# EAGLE design Module-StepDown (EAGLE 6.6.0)
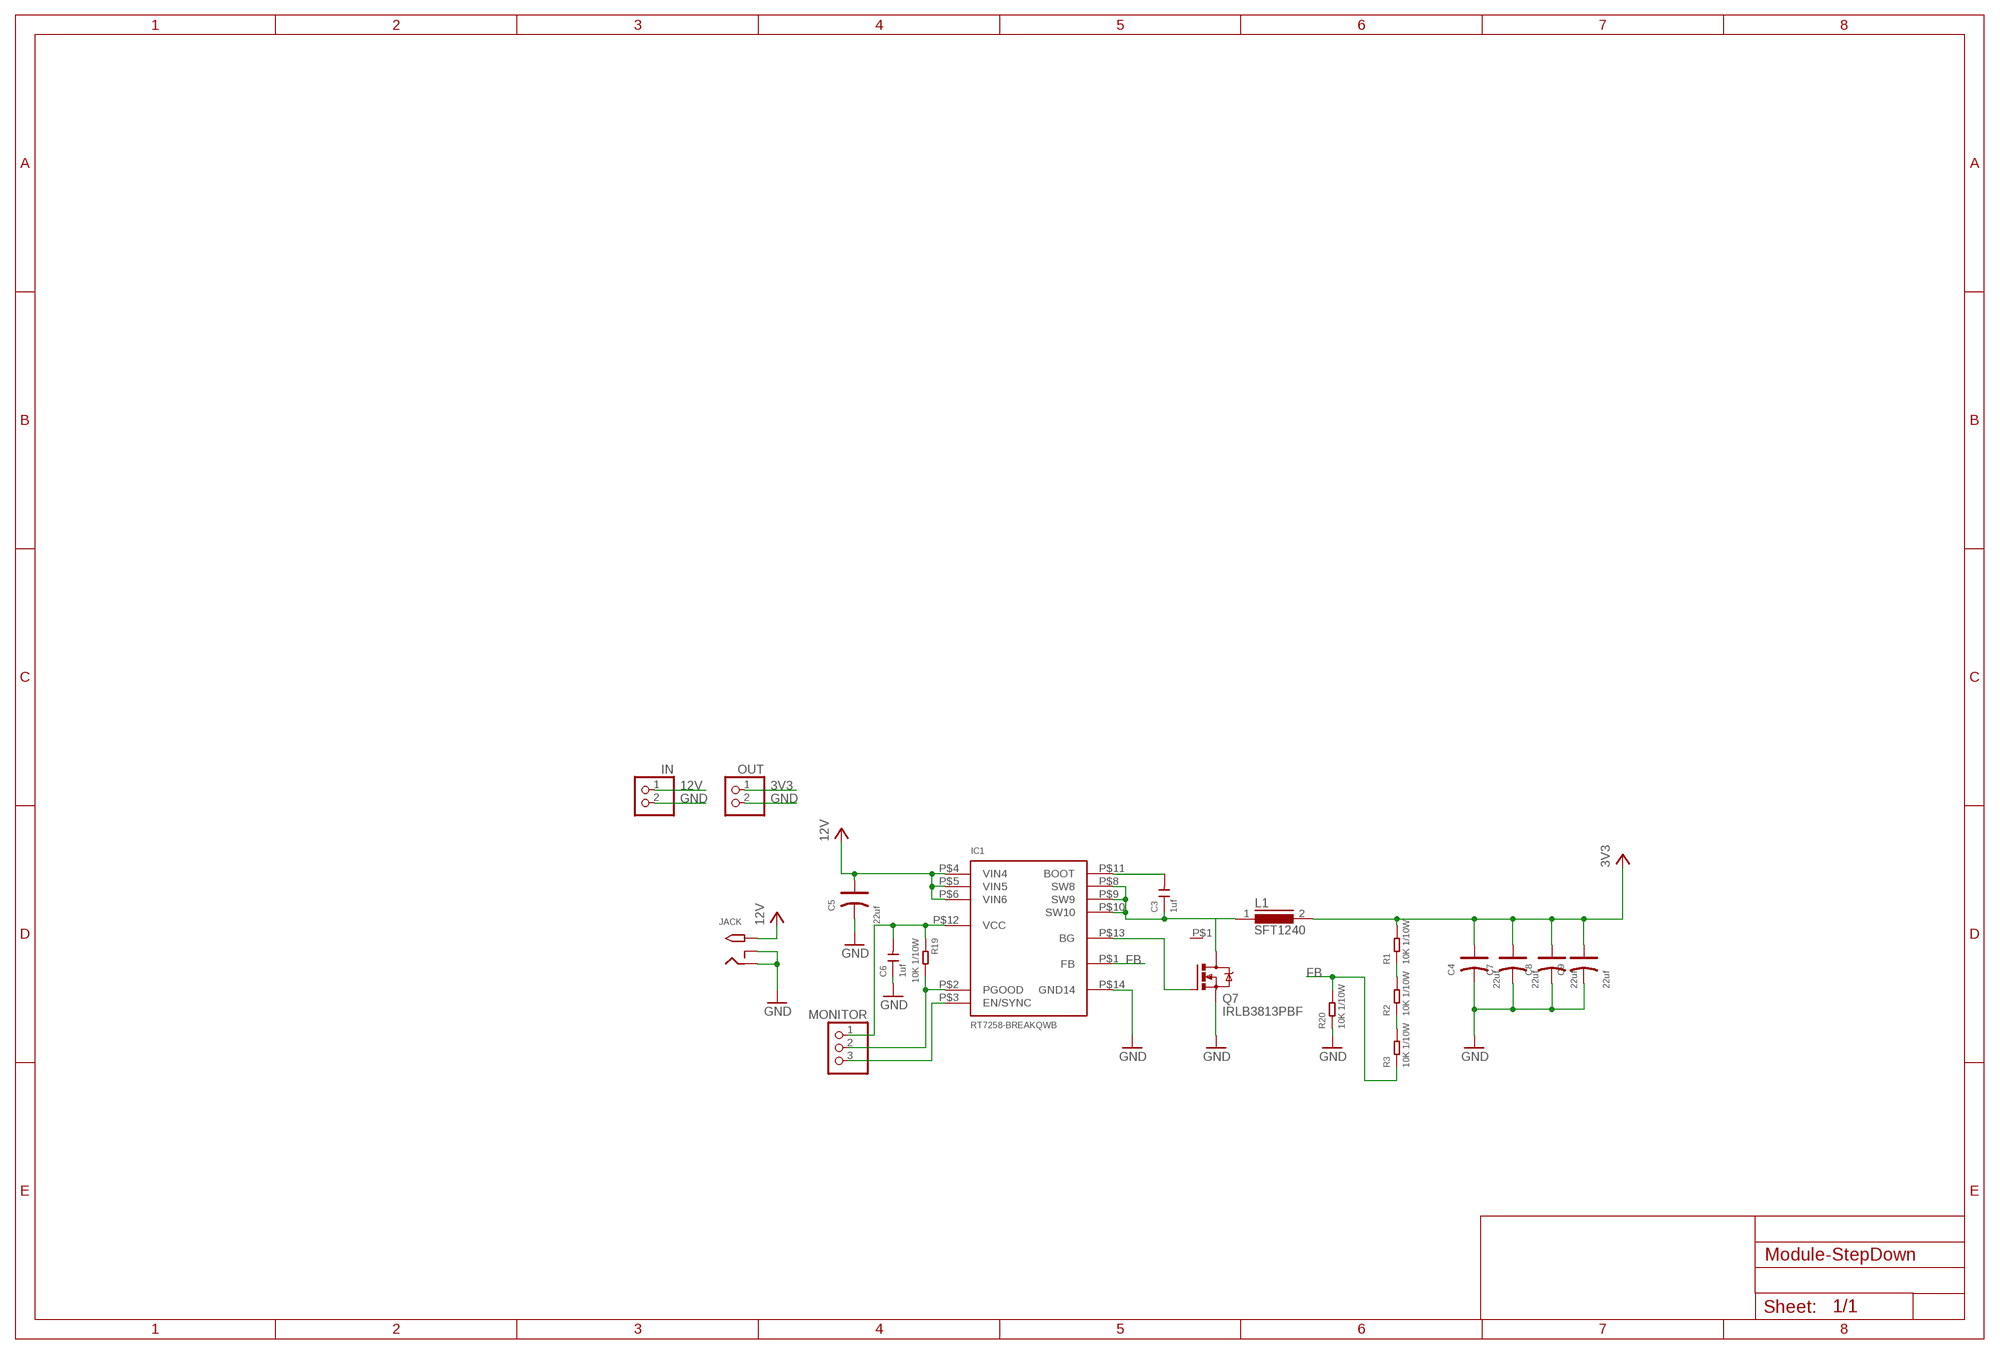
[diagram p0: schematic, sheet 1]

## Parts
C3  1uf  CERAMIC-1UF-25V-10%-X7R(0603)  [C0603]
C4  22uf  TANTALUM-SMD-22UF-16V(AVX-B)  [AVX-B]
C5  22uf  TANTALUM-SMD-22UF-16V(AVX-B)  [AVX-B]
C6  1uf  CERAMIC-1UF-25V-10%-X7R(0603)  [C0603]
C7  22uf  TANTALUM-SMD-22UF-16V(AVX-B)  [AVX-B]
C8  22uf  TANTALUM-SMD-22UF-16V(AVX-B)  [AVX-B]
C9  22uf  TANTALUM-SMD-22UF-16V(AVX-B)  [AVX-B]
HEATSINK1  HEAT111PB015  [HEAT11PB015]
IC1  RT7258-BREAKQWB  [RT7258GQW-BREAK]
IN  PINHD-1X2  [1X02]
JACK  2.1MMJACKTHM-NOOUT  [PJ-102A-NOOUT]
L1  SFT1240  [SFT1240]
MONITOR  PINHD-1X3  [1X03]
OUT  PINHD-1X2  [1X02]
Q7  IRLB3813PBF  IRF520  [TO220BV]
R1  10K 1/10W  SMD-RES-10K-5%-1/10W(0603)  [R0603]
R2  10K 1/10W  SMD-RES-10K-5%-1/10W(0603)  [R0603]
R3  10K 1/10W  SMD-RES-10K-5%-1/10W(0603)  [R0603]
R19  10K 1/10W  SMD-RES-10K-5%-1/10W(0603)  [R0603]
R20  10K 1/10W  SMD-RES-10K-5%-1/10W(0603)  [R0603]

## Nets
3V3: C4.+ C7.+ C8.+ C9.+ L1.2 OUT.1 R1.2
12V: C5.+ IC1.P$4(VIN4) IC1.P$5(VIN5) IC1.P$6(VIN6) IN.1 JACK.TIP
EN/SYNC: IC1.P$3(EN/SYNC) MONITOR.3
FB: IC1.P$1(FB) R3.1 R20.2
GND: C4.- C5.- C6.1 C7.- C8.- C9.- IC1.P$14(GND14) IN.2 JACK.RING JACK.RING_SW OUT.2 Q7.S R20.1
N$1: R2.1 R3.2
N$2: R1.1 R2.2
N$13: C3.2 IC1.P$11(BOOT)
N$15: IC1.P$13(BG) Q7.G
PGOOD: IC1.P$2(PGOOD) MONITOR.2 R19.2
SW: C3.1 IC1.P$8(SW8) IC1.P$9(SW9) IC1.P$10(SW10) L1.1 Q7.D
VCC: C6.2 IC1.P$12(VCC) MONITOR.1 R19.1
Unconnected: HEATSINK1.P$1

## Library data of the parts
C3 C6 = Seeed-Capacitor:CERAMIC-1UF-25V-10%-X7R(0603): 302010139; MPN: CC0603KRX7R8BB105
C4 C5 C7-C9 = Seeed-Capacitor:TANTALUM-SMD-22UF-16V(AVX-B): 302020013; MPN: TAJB226*016#NJ
HEATSINK1 = PCR-Connector:HEAT1
IC1 = PCR-IC:RT7258-BREAK
IN OUT = pinhead:PINHD-1X2: PIN HEADER
JACK = adafruit:2.1MMJACK: 2.1mm x 5.5mm THM DC jack with internal switch. Digikey part #PJ-102A, 4UCON part #05537 2.1mm x 5.5mm SMT DC jack with internal switch. Digikey part #PJ-002A-SMT, 4UCON part #03267 By microbuilder.eu & adafruit.com
L1 = inductors:SFT1240: INDUCTOR
MONITOR = pinhead:PINHD-1X3: PIN HEADER
Q7 = transistor-power:IRF520: HEXFET Power MOSFET
R1-R3 R19 R20 = Seeed-Resistor:SMD-RES-10K-5%-1/10W(0603): 301010293; MPN: RC0603JR-0710KL

## Net classes
1 2A: width 0.406 mm
2 8A: width 2.54 mm

## Board
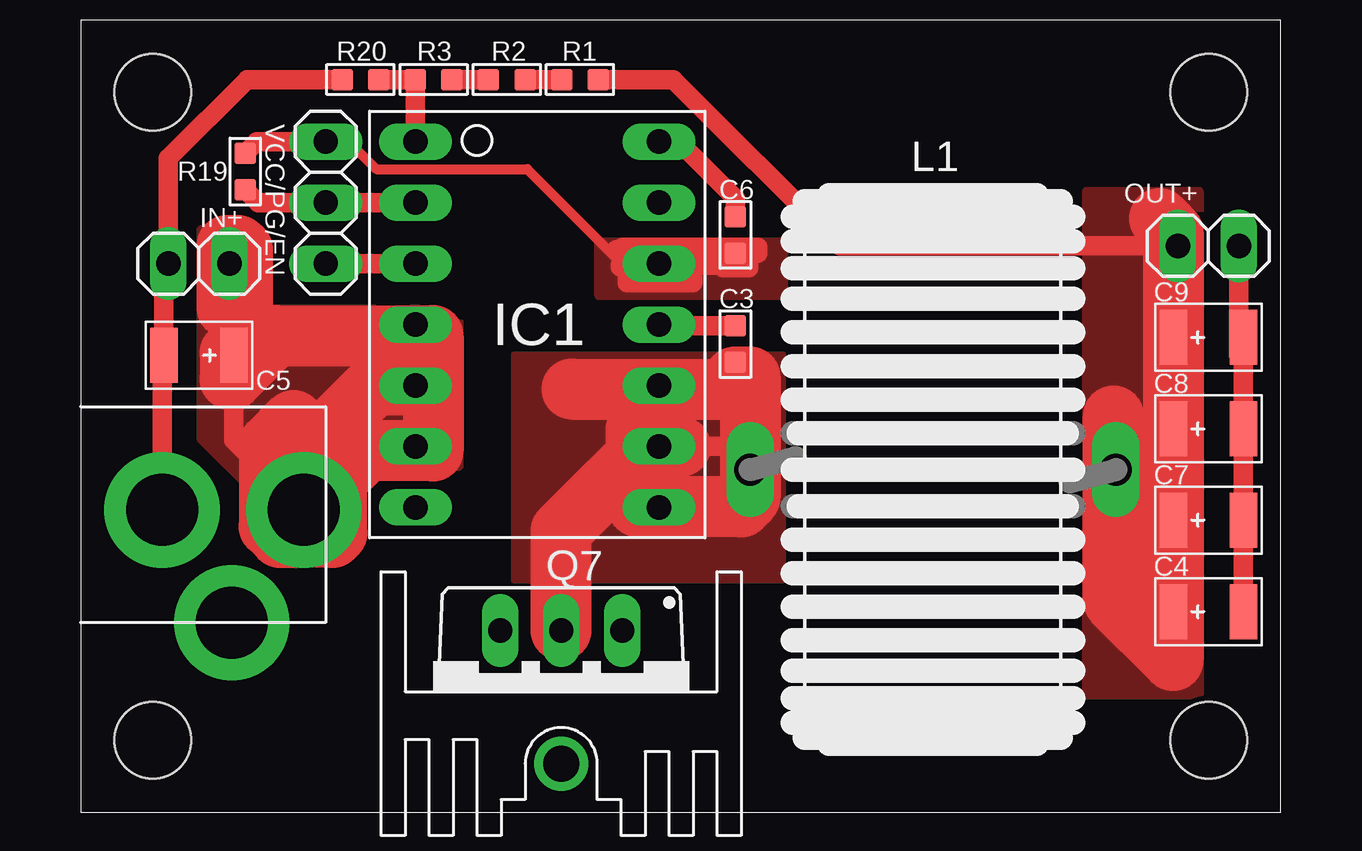
[diagram p1: board, top side]
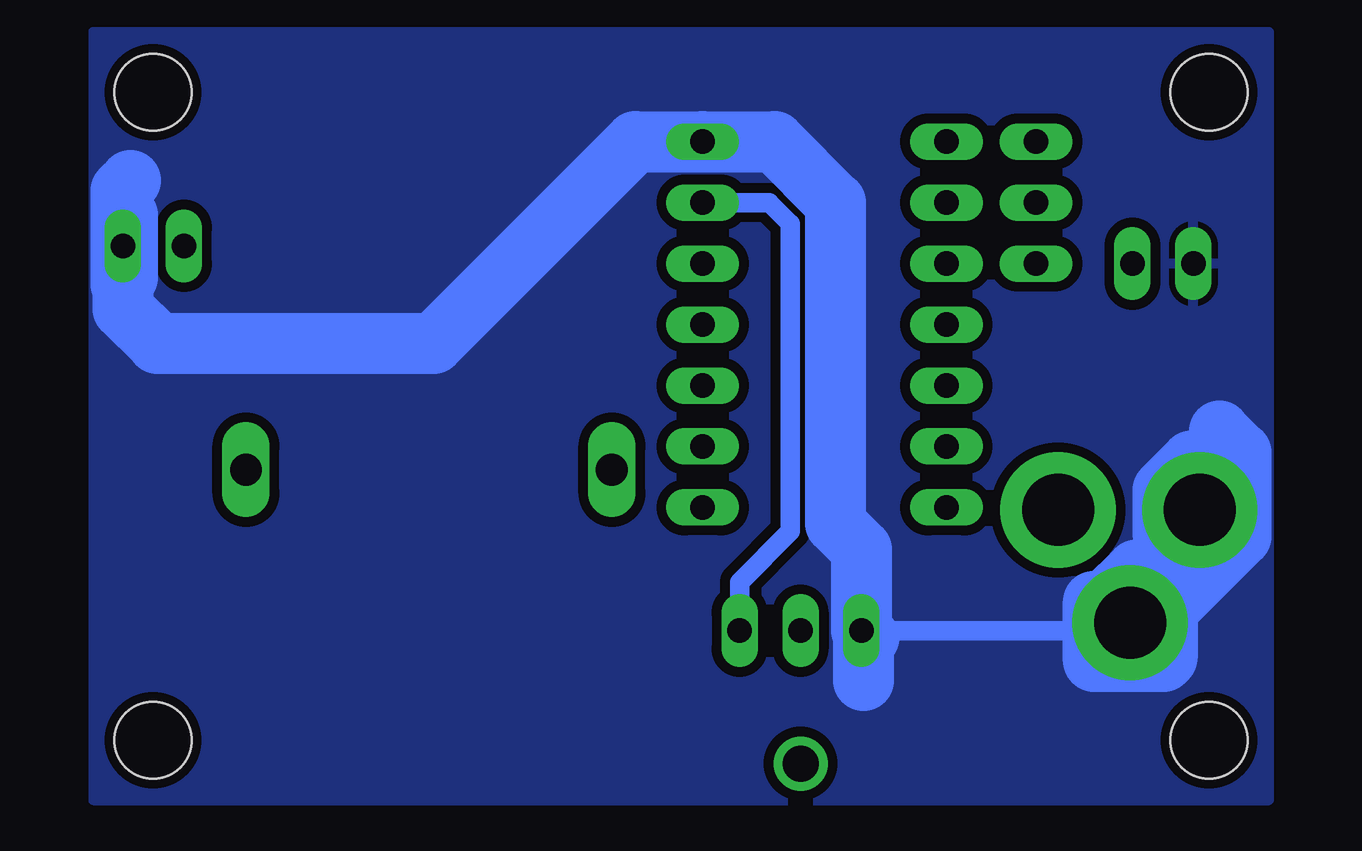
[diagram p2: board, bottom side, seen from below]

No outline drawn. Coordinates in mm, seen from the top.
Copper layers (1*16): Top 0.035mm / dielectric 1.5mm / Bottom 0.035mm
Design rules "SeeedStudio_2layer_DRU_no_angle_20140221": minimum track width 6mil, minimum drill 12mil, track to track 6mil, track to pad 6mil, pad to pad 6mil, via to via 6mil, smd to smd 0mil, copper to edge 10mil, drill to drill 10mil, minimum pad ring 10mil, minimum via ring 6mil, stop-mask expansion 2mil, vias tented up to drill 100mil, thermal gap 10mil
Holes 3.2 mm at 3,30 3,3 47,3 47,30

### Footprints (pad centres in the part's own frame; a part is rotated, then mirrored left to right if it is on the bottom)
C0603 = smd 0.889 x 0.889: 1 0,0.762; 2 0,-0.762
AVX-B = smd 1.143 x 2.286: + -1.46,0; - 1.46,0
HEAT11PB015 = drill 1.5: P$1 0,3
RT7258GQW-BREAK = drill 1.016 long: P$1 -5.08,7.62; P$2 -5.08,5.08; P$3 -5.08,2.54; P$4 -5.08,0; P$5 -5.08,-2.54; P$6 -5.08,-5.08; P$7 -5.08,-7.62; P$8 5.08,-7.62; P$9 5.08,-5.08; P$10 5.08,-2.54; P$11 5.08,0; P$12 5.08,2.54; P$13 5.08,5.08; P$14 5.08,7.62
1X02 = drill 1.016 long: 1 -1.27,0; 2 1.27,0
PJ-102A-NOOUT = drill 3 pad 4.8: RING 0.1,-3.39; RING_SW -4.6,-6.29; TIP 0.1,-9.29
SFT1240 = drill 1.321 long: 1 -7.62,0; 2 7.62,0
1X03 = drill 1.016 long: 1 -2.54,0; 2 0,0; 3 2.54,0
TO220BV = drill 1.016 long: D 0,-2.54; G -2.54,-2.54; S 2.54,-2.54
R0603 = smd 0.889 x 0.889: 1 0,0.762; 2 0,-0.762

### Placement (x,y rotation side)
C3  27.28,19.51 180 top
C4  46.99,8.36 0 top
C5  4.92,19.04 180 top
C6  27.28,24.05 0 top
C7  46.99,12.17 0 top
C8  46.99,15.98 0 top
C9  46.99,19.79 0 top
HEATSINK1  20.02,5.03 180 top
IC1  19.02,20.32 0 top
IN  4.92,22.86 180 top
JACK  0,12.5 90 top
L1  35.51,14.27 0 top
MONITOR  10.21,25.4 270 top
OUT  46.99,23.6 0 top
Q7  20.02,5.03 180 top
R1  20.8,30.53 90 top
R2  17.75,30.53 90 top
R3  14.7,30.53 90 top
R19  6.86,26.7 0 top
R20  11.66,30.53 90 top

### Tracks (layer width: path | path; a pad name or v marks a point on that pad's centre or on a via)
3V3
  Top 0.813: 45.53,14.35 C8.+ C9.+ 45.53,22.44 OUT.1 31.62,23.6 24.69,30.53 R1.2 | 45.53,14.35 C7.+ C4.+ | L1.2 43.2,14.35 45.53,14.35
  Top 2.54: 44.95,24.74 45.51,24.18 45.51,6.33 43.02,8.81 43.02,16.51
  pour Top: 46.58,25.86 46.58,4.9 41.93,4.9 41.93,25.86
12V
  Top 0.813: IC1.P$4 IC1.P$5 IC1.P$6 | IC1.P$6 13.75,15.05 | IC1.P$6 11.93,15.24 JACK.TIP 6.38,15.5 C5.+ 6.38,22.67 IN.1
  Top 2.54: 6.48,20.65 6.1,21.03 6.1,23.62 6.55,23.62 6.73,23.44 6.73,20.45 6.86,20.32 6.86,19.76 6.22,19.13 6.22,18.06 6.27,18.01 8.13,19.86 14.68,19.86 14.68,15.06 11.89,15.06 10.49,13.66 10.49,11.46 | 10.49,11.46 8.87,11.46 | 8.87,11.46 8.87,16.33 7.85,15.32 7.85,11.91 8.31,11.46 8.87,11.46 | 10.49,11.46 10.67,11.63 10.67,16.23 12.24,17.8 13.79,17.8
  pour Top: 5.03,24.26 5.03,15.57 7.26,13.34 11.48,13.34 12.57,14.43 15.75,14.43 15.75,20.93 7.42,20.93 7.42,24.26
EN/SYNC
  Top 0.813: IC1.P$3 MONITOR.3
FB
  Top 0.813: R20.2 R3.1 IC1.P$1
GND
  Top 0.813: C6.1 27.28,25.58 24.91,27.94 IC1.P$14 | C4.- C7.- C8.- C9.- 48.26,19.01 OUT.2 | R20.1 6.93,30.53 3.65,27.25 IN.2 3.46,22.67 C5.- 3.39,18.96 JACK.RING
  Bottom 0.813: JACK.RING 3.39,10.8 JACK.RING_SW 6.62,7.57 Q7.S
  Bottom 2.54: Q7.S 17.48,10.96 18.57,12.04 18.57,25.4 21.11,27.94 IC1.P$14 26.9,27.94 35.31,19.53 46.81,19.53 48.26,20.98 OUT.2 | 2.56,15.88 1.68,14.99 1.68,11.48 4.75,8.41 4.75,6.43 4.9,6.27 7.8,6.27 7.82,6.3 7.82,8.79 7.32,8.79 6.02,10.08 5.11,10.08 3.5,11.68 3.5,14.5 3.63,14.63 3.73,14.63 4.93,13.44 4.93,11.61 4.88,11.56 | 47.93,26.31 48.34,25.91 48.34,22 48.06,22.28 48.06,24.89 | 17.17,7.29 17.4,7.06 17.4,5.49
  pour Bottom (isolate 0.406): 0.5,32.5 49.5,32.5 49.5,0.5 0.5,0.5
N$1
  Top 0.813: R2.1 R3.2
N$2
  Top 0.813: R1.1 R2.2
N$13
  Top 0.813: IC1.P$11 24.15,20.27 C3.2
N$15
  Bottom 0.813: Q7.G 22.56,9.59 20.44,11.71 20.44,24.51 21.33,25.4 IC1.P$13
PGOOD
  Top 0.813: IC1.P$2 MONITOR.2 7.39,25.4 R19.2
SW
  Top 0.813: IC1.P$9 24.1,15.8 IC1.P$10 26.74,17.78 C3.1 | IC1.P$9 IC1.P$8 21.28,12.7 | L1.1 26.92,15.24 24.99,15.24 IC1.P$9
  Top 2.54: 20.47,17.63 27.25,17.63 27.25,18.14 27.89,18.14 27.89,13.11 27.5,12.72 23.24,12.72 23.14,12.83 23.14,15.95 23.85,15.24 24.99,15.24 | Q7.D 20.02,11.72 24.1,15.8
  pour Top: 18.06,19.08 29.26,19.08 29.26,9.65 18.06,9.65
VCC
  Top 0.406: MONITOR.1 11.17,27.94 12.32,26.8 18.61,26.8 22.55,22.86 IC1.P$12 26.84,22.86 C6.2
  Top 0.813: MONITOR.1 7.34,27.94 R19.1 | 22.32,23.44 22.58,23.44 22.58,23.55 28.22,23.55 28.22,23.29 27.84,23.29 27.84,22.68 26.77,22.68 26.77,22.78 22.48,22.78 22.48,22.73 22.78,22.73 22.78,22.07 25.5,22.07 25.5,22.25
  pour Top: 21.61,23.75 29.26,23.75 29.26,21.54 21.61,21.54

### Text on the board
tPlace: R20 | R3 | R2 | R1 | VCC/PG/EN | L1 | R19 | C6 | OUT+ | IN+ | C3 | C9 | IC1 | C5 | C8 | C7 | Q7 | C4
tDocu: 50 x 33 mm